# EAGLE design Schematic (EAGLE 9.6.2)
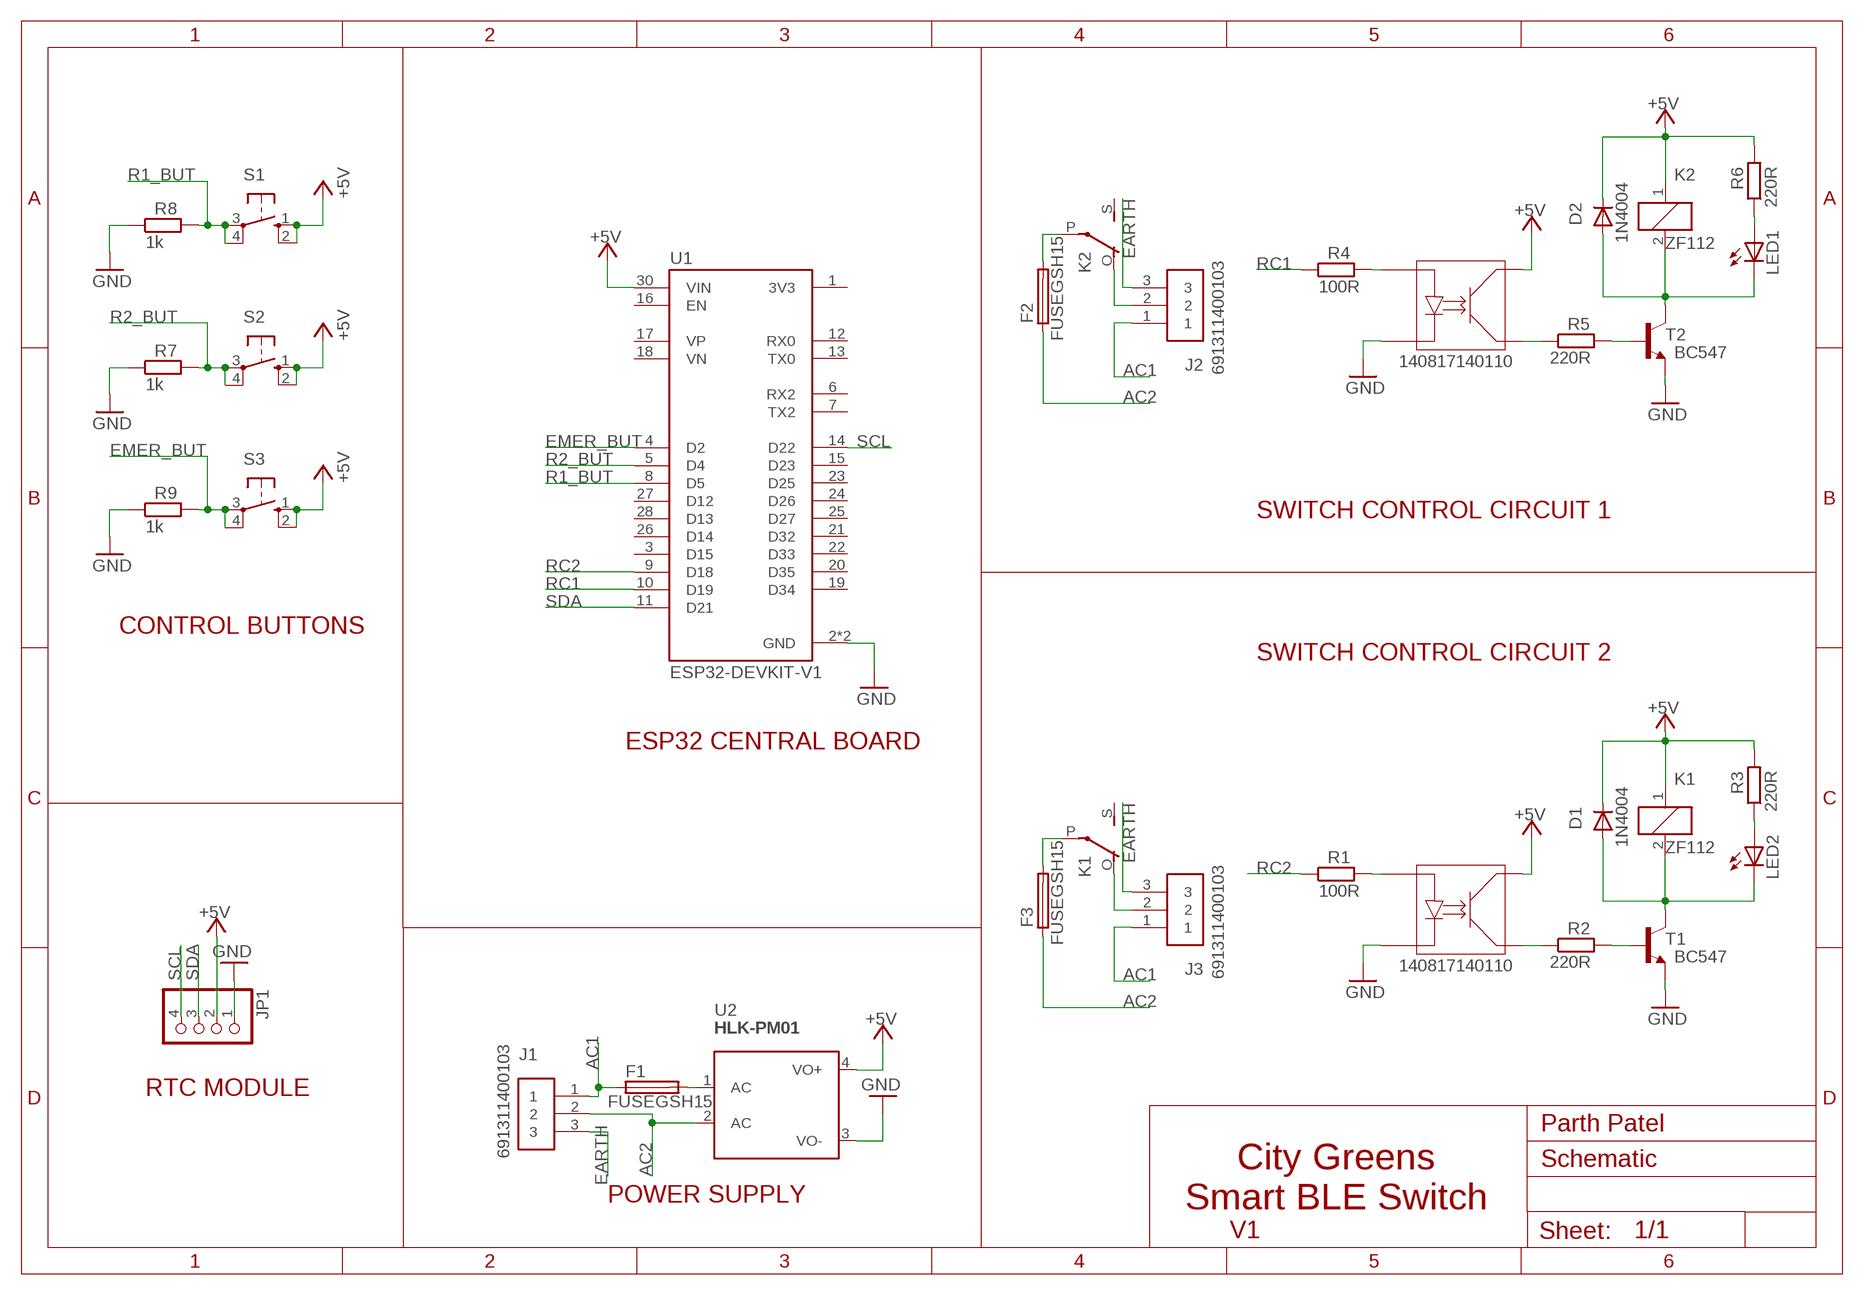
[diagram p0: schematic, sheet 1]

## Parts
D1  1N4004  [DO41-10]
D2  1N4004  [DO41-10]
F1  FUSEGSH15  [GSH15]
F2  FUSEGSH15  [GSH15]
F3  FUSEGSH15  [GSH15]
J1  691311400103  [TERMINALBLOCK_PLUGGABLE-3-7.62MM]
J2  691311400103  [TERMINALBLOCK_PLUGGABLE-3-7.62MM]
J3  691311400103  [TERMINALBLOCK_PLUGGABLE-3-7.62MM]
JP1  PINHD-1X4  [1X04]
K1  ZF112  [ZF112]
K2  ZF112  [ZF112]
LED1  LED3MM  [LED3MM]
LED2  LED3MM  [LED3MM]
O1  140817140110  [140817140110]
O2  140817140110  [140817140110]
R1  100R  R-EU_0207/10  [0207/10]
R2  220R  R-EU_0207/10  [0207/10]
R3  220R  R-EU_0207/10  [0207/10]
R4  100R  R-EU_0207/10  [0207/10]
R5  220R  R-EU_0207/10  [0207/10]
R6  220R  R-EU_0207/10  [0207/10]
R7  1k  R-EU_0207/10  [0207/10]
R8  1k  R-EU_0207/10  [0207/10]
R9  1k  R-EU_0207/10  [0207/10]
S1  10-XX  [B3F-10XX]
S2  10-XX  [B3F-10XX]
S3  10-XX  [B3F-10XX]
T1  BC547  -NPN-TO92  [TO92]
T2  BC547  -NPN-TO92  [TO92]
U1  ESP32-DEVKIT-V1  [MODULE_ESP32_DEVKIT_V1]
U2  HLK-PM01  [HLK-PM01]

## Nets
+5V: D1.C D2.C JP1.2 K1.1 K2.1 O1.4 O2.4 R3.2 R6.2 S1.1(S) S1.2(S1) S2.1(S) S2.2(S1) S3.1(S) S3.2(S1) U1.30(VIN) U2.4(VO+)
AC1: F1.1 J1.1 J2.1 J3.1
AC2: F2.1 F3.1 J1.2 U2.2(AC)
EARTH: J1.3 J2.3 J3.3
EMER_BUT: R9.2 S3.3(P) S3.4(P1) U1.4(D2)
GND: JP1.1 O1.2 O2.2 R7.1 R8.1 R9.1 T1.1(E) T2.1(E) U1.2(GND) U1.29(GND) U2.3(VO-)
N$1: F1.2 U2.1(AC)
N$2: O1.3 R2.1
N$3: O1.1 R1.2
N$4: R2.2 T1.2(B)
N$5: F3.2 K1.P(2:P)
N$6: D1.A K1.2 LED2.K(C) T1.3(C)
N$7: LED2.A R3.1
N$8: J3.2 K1.O(2:O)
N$9: O2.1 R4.2
N$10: O2.3 R5.1
N$11: R5.2 T2.2(B)
N$12: D2.A K2.2 LED1.K(C) T2.3(C)
N$13: LED1.A R6.1
N$14: F2.2 K2.P(2:P)
N$15: J2.2 K2.O(2:O)
R1_BUT: R8.2 S1.3(P) S1.4(P1) U1.8(D5)
R2_BUT: R7.2 S2.3(P) S2.4(P1) U1.5(D4)
RC1: R4.1 U1.10(D19)
RC2: R1.1 U1.9(D18)
SCL: JP1.4 U1.14(D22)
SDA: JP1.3 U1.11(D21)
Unconnected: K1.S(2:S) K2.S(2:S) U1.1(3V3) U1.3(D15) U1.6(RX2) U1.7(TX2) U1.12(RX0) U1.13(TX0) U1.15(D23) U1.16(EN) U1.17(VP) U1.18(VN) U1.19(D34) U1.20(D35) U1.21(D32) U1.22(D33) U1.23(D25) U1.24(D26) U1.25(D27) U1.26(D14) U1.27(D12) U1.28(D13)

## Notes on the sheet
- SWITCH CONTROL CIRCUIT 1
- CONTROL BUTTONS
- SWITCH CONTROL CIRCUIT 2
- ESP32 CENTRAL BOARD
- RTC MODULE
- Parth Patel
- City Greens
  Smart BLE Switch
- POWER SUPPLY
- V1

## Library data of the parts
D1 D2 = adafruit:1N4004: DIODE General purpose 1N400x type rectifier (With bigger pads) http://www.ladyada.net/library/pcb/eaglelibrary.html
F1-F3 = fuse:FUSE: Fuse; OC_FARNELL: unknown; OC_NEWARK: unknown
J1-J3 = Terminal Blocks:691311400103: 7.62MM CLOSE VERTICAL PCB HEADER WR-TBL Manufacturer's datasheet <https://katalog.we-online.com/em/datasheet/6913114001xx.pdf>; CREATED_BY: PCBLayout.com; DIGIKEY_PART_NO: 732-2824-ND; MANUFACTURER: WURTH ELEKTRONIK; MPN: 691311400103
JP1 = pinhead:PINHD-1X4: PIN HEADER
K1 K2 = relay:ZF112: RELAY 1 x switch; OC_FARNELL: unknown; OC_NEWARK: unknown
LED1 LED2 = adafruit:LED: LED OSRAM: - CHIPLED LG R971, LG N971, LY N971, LG Q971, LY Q971, LO R971, LY R971 LH N974, LH R974 LS Q976, LO Q976, LY Q976 LO Q996 - Hyper CHIPLED LW Q18S LB Q993, LB Q99A, LB R99A - SideLED LS A670, LO A670, LY A670, LG A670, LP A670 LB A673, LV A673, LT A673, LW A673 LH A674 LY A675 LS A676, LA A676, LO A676, LY A676, LW A676 LS A679, LY A679, LG A679 - Hyper Micro SIDELED® LS Y876, LA Y876, LO Y876, LY Y876 LT Y87S - SmartLED LW L88C, LW L88S LB L89C, LB L89S, LG L890 LS L89K, LO L89K, LY L89K LS L896, LA L896, LO L896, LY L896 - TOPLED LS T670, LO T670, LY T670, LG T670, LP T670 LSG T670, LSP T670, LSY T670, LOP T670, LYG T670 LG T671, LOG T671, LSG T671 LB T673, LV T673, LT T673, LW T673 LH T674 LS T676, LA T676, LO T676, LY T676, LB T676, LH T676, LSB T676, LW T676 LB T67C, LV T67C, LT T67C, LS T67K, LO T67K, LY T67K, LW E67C LS E67B, LA E67B, LO E67B, LY E67B, LB E67C, LV E67C, LT E67C LW T67C LS T679, LY T679, LG T679 LS T770, LO T770, LY T770, LG T770, LP T770 LB T773, LV T773, LT T773, LW T773 LH T774 LS E675, LA E675, LY E675, LS T675 LS T776, LA T776, LO T776, LY T776, LB T776 LHGB T686 LT T68C, LB T68C - Hyper Mini TOPLED® LB M676 - Mini TOPLED Santana® LG M470 LS M47K, LO M47K, LY M47K Source: http://www.osram.convergy.de/
O1 O2 = 140817140110 Optocoupler:140817140110
R1-R9 = rcl:R-EU_: RESISTOR, European symbol; SPICEPREFIX: R
S1-S3 = switch-omron:10-XX: OMRON SWITCH; MPN: B3F-1000; OC_FARNELL: 176432; OC_NEWARK: 36M3542
T1 T2 = transistor:*-NPN-: NPN Transistror BF959 corrected 2008.03.06
U1 = ESP32-DEVKIT-V1:ESP32-DEVKIT-V1: Dual core, Wi-Fi: 2.4 GHz up to 150 Mbits/s,BLE (Bluetooth Low Energy) and legacy Bluetooth, 32 bits, Up to 240 MHz Check prices <https://pricing.snapeda.com/parts/ESP32-DEVKIT-V1/Do%20it/view-part?ref=eda>; AVAILABILITY: Not in stock; DESCRIPTION: Dual core, Wi-Fi: 2.4 GHz up to 150 Mbits/s,BLE (Bluetooth Low Energy) and legacy Bluetooth, 32 bits, Up to 240 MHz; MF: Do it; MP: ESP32-DEVKIT-V1; PACKAGE: None; PRICE: None
U2 = Hi-Link AC to DC Power Supply:HLK-PM01: Check prices <https://pricing.snapeda.com/parts/hlk-pm01/Hi-link/view-part?ref=eda>; AVAILABILITY: Not in stock; DESCRIPTION: The 3W ultra-small series module power supply is a small-volume, high-efficiency AC DC power module supply designed by Shenzhen Hi-Link Electronics Co.,Ltd. It has the advantages of global input voltage range, low temperature rise, low power consumption,high efficiency, high reliability and high safety isolation. It has been widely used in smart home, automation control, communications equipment, instrumentation and other industries.; MF: Hi-link; MP: hlk-pm01; PACKAGE: None; PRICE: None

## Board
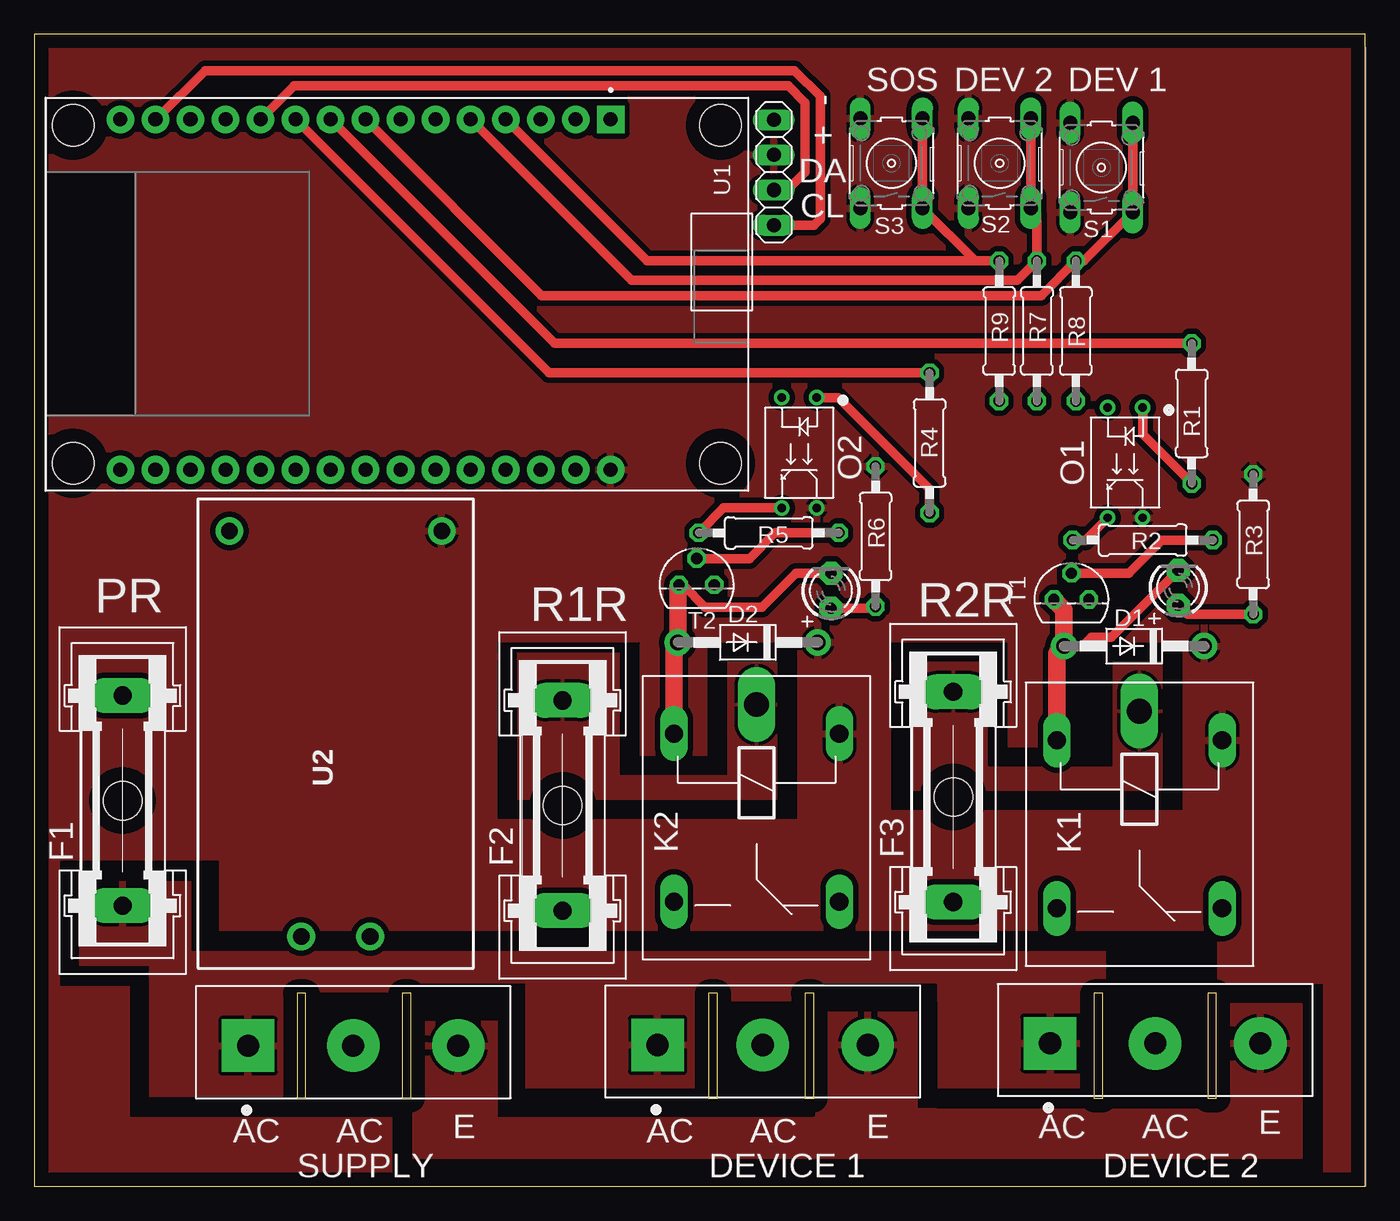
[diagram p1: board, top side]
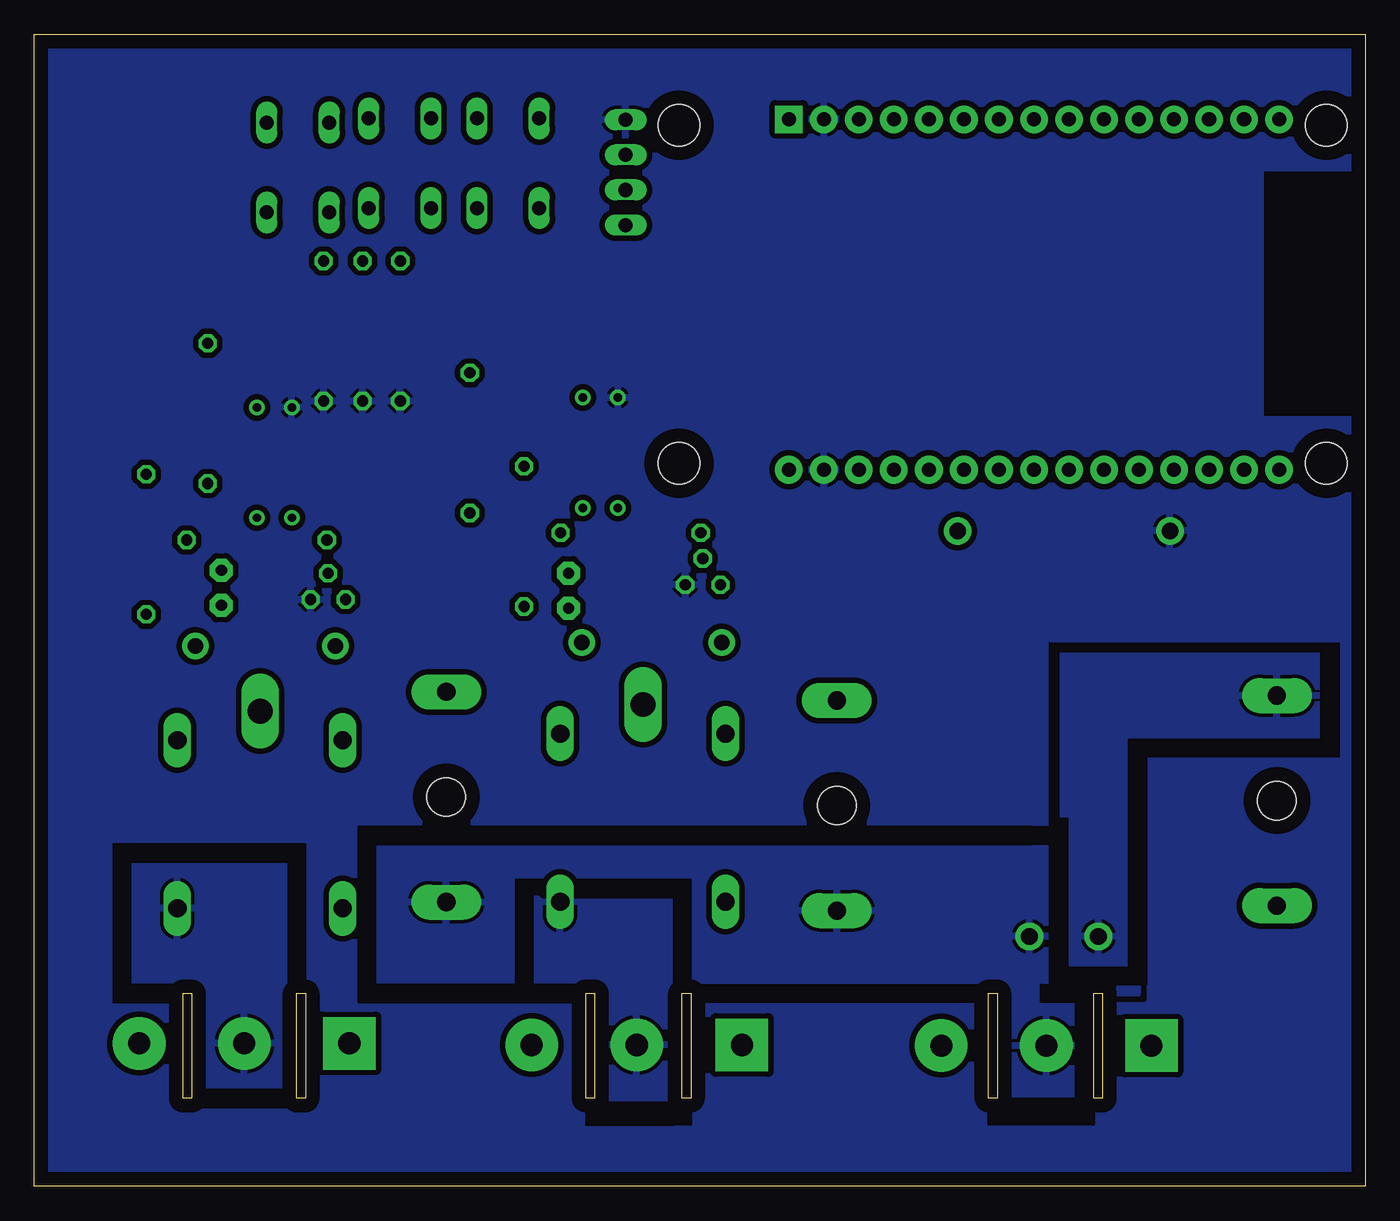
[diagram p2: board, bottom side, seen from below]

Size 96.5 x 83.49 mm. Coordinates in mm from the lower left corner, seen from the top.
Outline: 0,0 96.5,0 96.5,83.49 0,83.49 0,0
Outline: 19.05,13.97 19.05,6.35 19.68,6.35 19.68,13.97 19.05,13.97
Outline: 26.67,13.97 26.67,6.35 27.3,6.35 27.3,13.97 26.67,13.97
Outline: 48.9,13.97 48.9,6.35 49.53,6.35 49.53,13.97 48.9,13.97
Outline: 55.88,13.97 55.88,6.35 56.52,6.35 56.52,13.97 55.88,13.97
Outline: 76.83,13.97 76.83,6.35 77.47,6.35 77.47,13.97 76.83,13.97
Outline: 85.09,13.97 85.09,6.35 85.72,6.35 85.72,13.97 85.09,13.97
Copper layers (1*16): Top 0.035mm / dielectric 1.5mm / Bottom 0.035mm
Design rules "default *": minimum track width 0.6mm, minimum drill 0.35mm, track to track 0.4mm, track to pad 0.4mm, pad to pad 0.4mm, via to via 0.4mm, smd to smd 0.4mm, copper to edge 40mil, drill to drill 6mil, minimum pad ring 10mil, minimum via ring 8mil, stop-mask expansion 4mil, vias tented up to drill 0mil, thermal gap 10mil
tRestrict: area 33.7,26.7 to 55.2,39.4; area 33.7,38.1 to 34.9,38.7; area 1.9,5.1 to 85.7,23.5; area 1.9,21.6 to 3.2,22.2; area 26,0.6 to 93.3,14.6; area 27.3,12.1 to 29.2,12.7; area 62.2,27.3 to 83.2,39.4; area 62.2,36.8 to 64.1,38.1; area 20.3,5.7 to 26.7,14; area 50.2,5.1 to 55.9,13.3; area 77.5,6.3 to 85.1,14.6
bRestrict: area 1.9,14.6 to 22.9,39.4; area 1.9,37.5 to 3.2,38.7; area 48.9,4.4 to 61.6,22.2; area 48.9,4.4 to 50.2,6.3; area 24.1,13.3 to 73,26; area 22.9,24.8 to 24.1,26; area 19.7,4.4 to 49.5,14.6; area 76.8,5.7 to 90.8,24.8; area 76.8,5.7 to 78.1,7.6

### Footprints (pad centres in the part's own frame; a part is rotated, then mirrored left to right if it is on the bottom)
DO41-10 = drill 1.118 pad 1.93: A 5.08,0; C -5.08,0
GSH15 = drill 1.321 pad 2.54 long: 1 -7.62,0; 2 7.62,0 | hole 2.794: 0,0
TERMINALBLOCK_PLUGGABLE-3-7.62MM = drill 1.6 pad 3.81 square: 1 -7.62,0 | drill 1.6 pad 3.81: 2 0,0; 3 7.62,0
1X04 = drill 1.016 long: 1 -3.81,0; 2 -1.27,0; 3 1.27,0; 4 3.81,0
ZF112 = drill 1.321 long: 1 -6.096,5.994; 2 -6.096,-5.994; O 6.096,5.994; S 6.096,-5.994 | drill 1.803 long: P -8.204,0
LED3MM = drill 0.813 pad 1.676 octagon: A -1.27,0; K 1.27,0
140817140110 = drill 0.6: 1 -4,1.27; 2 -4,-1.27; 3 4,-1.27; 4 4,1.27
0207/10 = drill 0.813 octagon: 1 -5.08,0; 2 5.08,0
B3F-10XX = drill 1.016 long: 1 -3.251,2.261; 2 3.251,2.261; 3 -3.251,-2.261; 4 3.251,-2.261
TO92 = drill 0.813 octagon: 1 1.27,0; 2 0,1.905; 3 -1.27,0
MODULE_ESP32_DEVKIT_V1 = drill 1.02 pad 2 square: 1 -12.7,15.515 | drill 1.02 pad 2: 2 -12.7,12.975; 3 -12.7,10.435; 4 -12.7,7.895; 5 -12.7,5.355; 6 -12.7,2.815; 7 -12.7,0.275; 8 -12.7,-2.265; 9 -12.7,-4.805; 10 -12.7,-7.345; 11 -12.7,-9.885; 12 -12.7,-12.425; 13 -12.7,-14.965; 14 -12.7,-17.505; 15 -12.7,-20.045; 16 12.7,-20.045; 17 12.7,-17.505; 18 12.7,-14.965; 19 12.7,-12.425; 20 12.7,-9.885; 21 12.7,-7.345; 22 12.7,-4.805; 23 12.7,-2.265; 24 12.7,0.275; 25 12.7,2.815; 26 12.7,5.355; 27 12.7,7.895; 28 12.7,10.435; 29 12.7,12.975; 30 12.7,15.515 | hole 3: -12.28,-23.475; 12.23,-23.475; 12.23,23.475; -12.28,23.475
HLK-PM01 = drill 1.2 pad 2: 1 -14.7,2.5; 2 -14.7,-2.5; 3 14.7,7.7; 4 14.7,-7.7

### Placement (x,y rotation side)
D1  79.75,39.15 180 top
D2  51.73,39.41 180 top
F1  6.39,27.95 90 top
F2  38.3,27.59 90 top
F3  66.64,28.21 90 top
J1  23.11,10.18 0 top
J2  52.82,10.23 0 top
J3  81.28,10.35 0 top
JP1  53.62,73.48 270 top
K1  80.14,26.23 270 top
K2  52.37,26.7 270 top
LED1  57.77,43.16 90 top
LED2  82.95,43.37 90 top
O1  79.11,52.45 270 top
O2  55.47,53.16 270 top
R1  83.93,56.02 270 top
R2  80.38,46.84 0 top
R3  88.39,46.53 90 top
R4  64.92,53.88 270 top
R5  53.26,47.36 0 top
R6  61,47.1 90 top
R7  72.7,61.99 90 top
R8  75.53,61.99 90 top
R9  69.97,61.99 90 top
S1  77.39,73.85 90 top
S2  70,74.16 90 top
S3  62.16,74.16 90 top
T1  75.2,42.52 0 top
T2  48.02,43.59 0 top
U1  26.28,64.63 270 top
U2  21.84,32.8 90 top

### Tracks (layer width: path | path; a pad name or v marks a point on that pad's centre or on a via)
+5V
  pour Top (rank 6): -5.08,86.36 -5.08,-5.08 101.6,-5.08 101.6,86.36
AC1
  pour Top: 2.54,22.86 2.54,15.24 7.62,15.24 7.62,5.71 26.67,5.71 26.67,13.97 34.92,13.97 34.92,6.35 55.88,6.35 55.88,13.97 64.77,13.97 64.77,6.35 77.47,6.35 77.47,17.78 12.7,17.78 12.7,22.86
AC2
  pour Bottom (rank 2): 20.32,5.71 26.67,5.71 26.67,13.97 72.39,13.97 72.39,25.4 22.23,25.4 22.23,13.97 20.32,13.97
EARTH
  pour Top (rank 2): 26.67,13.97 26.67,1.27 92.71,1.27 92.71,13.97 85.09,13.97 85.09,6.35 64.77,6.35 64.77,13.97 55.88,13.97 55.88,6.35 34.92,6.35 34.92,13.97
EMER_BUT
  Top 0.7: S3.4 S3.3 68.25,67.07 R9.2 44.43,67.07 U1.4
GND
  pour Bottom (rank 6): -3.81,86.36 -3.81,-2.54 101.6,-2.54 101.6,86.36
N$1
  pour Bottom: 2.54,38.73 2.54,31.75 16.51,31.75 16.51,13.97 22.23,13.97 22.23,38.73
N$2
  Top 0.7: O1.3 76.22,46.84 R2.1
N$3
  Top 0.7: O1.1 80.38,54.49 R1.2
N$4
  Top 0.7: T1.2 79.35,44.43 81.76,46.84 R2.2
N$5
  pour Top: 62.87,38.73 69.85,38.73 69.85,31.11 77.47,31.11 77.47,38.73 82.55,38.73 82.55,27.94 62.87,27.94
N$6
  Top 0.7: D1.A 76.02,39.15 76.66,39.8 78.1,39.8 LED2.K
  Top 1.27: K1.2 74.15,38.63 D1.A 74.67,41.78 T1.3
N$7
  Top 0.7: LED2.A 83.6,41.45 R3.1
N$8
  pour Bottom: 77.47,6.35 85.09,6.35 85.09,13.97 90.17,13.97 90.17,24.13 77.47,24.13
N$9
  Top 0.7: O2.1 58.3,57.16 64.92,50.54 R4.2
N$10
  Top 0.7: R5.1 49.98,49.16 O2.3
N$11
  Top 0.7: T2.2 51.84,45.49 53.71,47.36 R5.2
N$12
  Top 0.7: T2.3 47.02,43.59 48.63,41.98 52.77,41.98 55.23,44.44 LED1.K
  Top 1.27: K2.2 46.38,39.14 D2.A 46.66,43.49 T2.3
N$13
  Top 0.7: LED1.A 60.87,41.9 R6.1
N$14
  pour Top: 34.29,38.73 43.18,38.73 43.18,30.48 49.53,30.48 49.53,38.73 54.61,38.73 54.61,27.3 34.29,27.3
N$15
  pour Bottom: 48.9,6.35 55.88,6.35 55.88,13.97 60.96,13.97 60.96,21.59 48.9,21.59
R1_BUT
  Top 0.7: S1.4 S1.3 76.12,67.07 R8.2 73.02,64.56 36.78,64.56 U1.8
R2_BUT
  Top 0.7: S2.4 S2.3 72.7,70.47 R7.2 71.29,65.66 43.3,65.66 U1.5
RC1
  Top 0.7: R4.1 37.31,58.96 U1.10
RC2
  Top 0.7: U1.9 37.71,61.1 R1.1
SCL
  Top 0.7: U1.14 8.84,77.33 12.38,80.88 55.12,80.88 56.99,79.01 56.99,70.15 56.52,69.67 JP1.4
SDA
  Top 0.6: JP1.3 54.61,72.22
  Top 0.7: 54.61,72.22 55.89,73.49 55.89,78.56 54.67,79.78 18.84,79.78 U1.11

### Text on the board
tPlace: - | SOS | DEV 2 | DEV 1 | + | DA | CL | PR | R1R | R2R | E | AC | AC | E | AC | AC | E | AC | AC | SUPPLY | DEVICE 1 | DEVICE 2